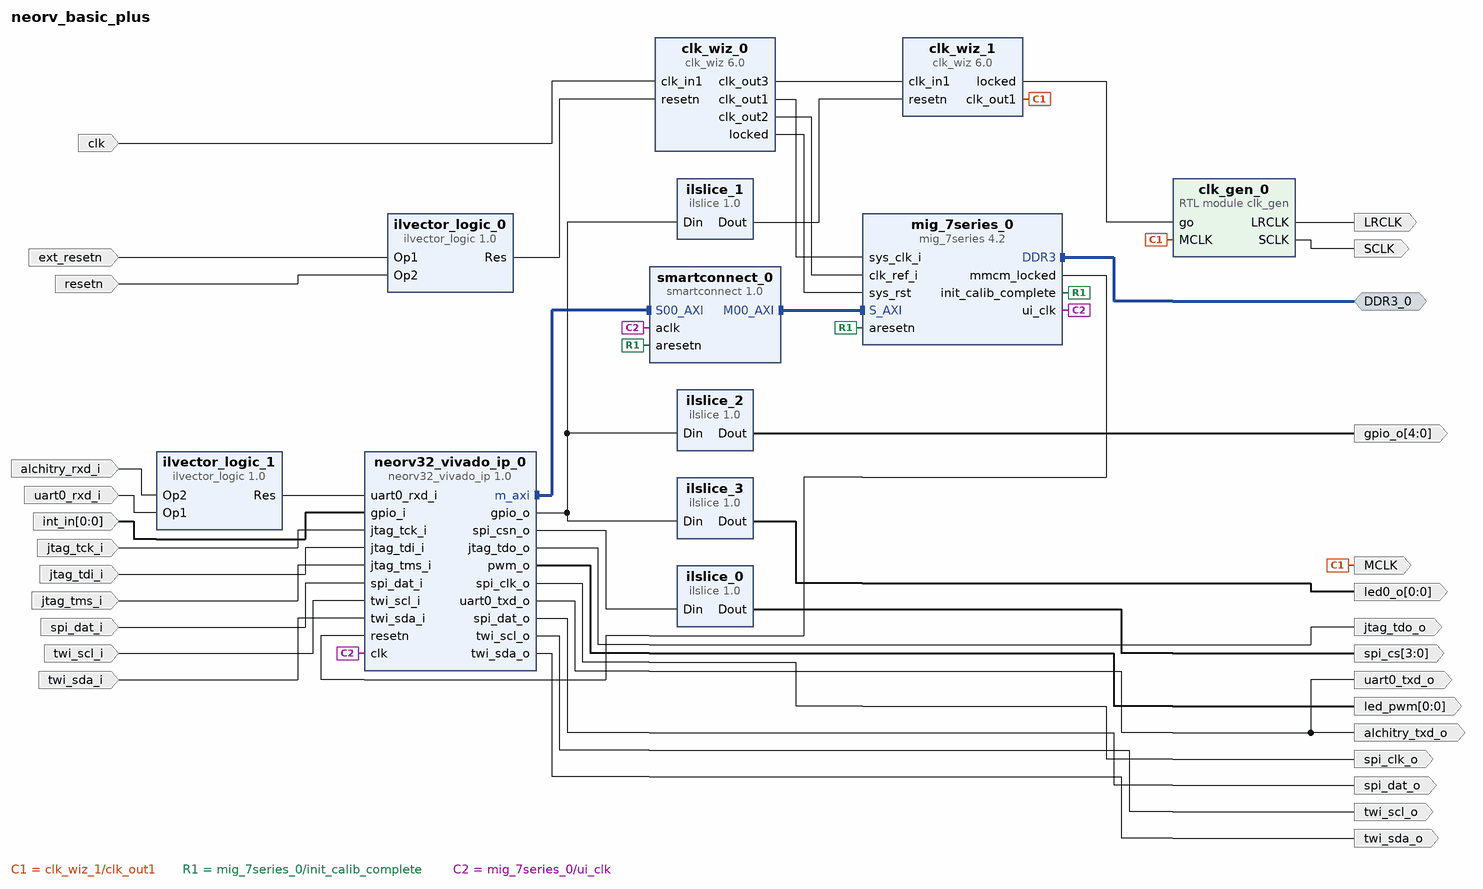
[diagram p0: block diagram of the top level]
# Vivado block design neorv_basic_plus, xc7a100tfgg484-2, Vivado 2025.2
create_bd_design neorv_basic_plus

create_bd_intf_port -mode Master -vlnv xilinx.com:interface:ddrx_rtl:1.0 DDR3_0
create_bd_port -dir O LRCLK
create_bd_port -dir O SCLK
create_bd_port -dir I -type clk clk
set_property -dict {CONFIG.ASSOCIATED_RESET ext_resetn} [get_bd_ports clk]
create_bd_port -dir I -from 0 -to 0 int_in
create_bd_port -dir O -from 4 -to 0 gpio_o
create_bd_port -dir I jtag_tck_i
create_bd_port -dir I jtag_tdi_i
create_bd_port -dir O jtag_tdo_o
create_bd_port -dir I jtag_tms_i
create_bd_port -dir O -from 0 -to 0 led_pwm
create_bd_port -dir I -type rst resetn
create_bd_port -dir O spi_clk_o
create_bd_port -dir I spi_dat_i
create_bd_port -dir O spi_dat_o
create_bd_port -dir I twi_scl_i
create_bd_port -dir O twi_scl_o
create_bd_port -dir I twi_sda_i
create_bd_port -dir O twi_sda_o
create_bd_port -dir I uart0_rxd_i
create_bd_port -dir O uart0_txd_o
create_bd_port -dir O -from 3 -to 0 spi_cs
create_bd_port -dir O -type clk MCLK
create_bd_port -dir I -type rst ext_resetn
create_bd_port -dir O -from 0 -to 0 led0_o
create_bd_port -dir I alchitry_rxd_i
create_bd_port -dir O alchitry_txd_o

create_bd_cell -type module -reference clk_gen clk_gen_0
create_bd_cell -type ip -vlnv xilinx.com:ip:clk_wiz:6.0 clk_wiz_0
set_property -dict [list \
  CONFIG.CLKOUT1_JITTER 130.958 \
  CONFIG.CLKOUT1_PHASE_ERROR 98.575 \
  CONFIG.CLKOUT1_REQUESTED_OUT_FREQ 100 \
  CONFIG.CLKOUT1_USED true \
  CONFIG.CLKOUT2_JITTER 114.829 \
  CONFIG.CLKOUT2_PHASE_ERROR 98.575 \
  CONFIG.CLKOUT2_REQUESTED_OUT_FREQ 200 \
  CONFIG.CLKOUT2_USED true \
  CONFIG.CLKOUT3_JITTER 130.958 \
  CONFIG.CLKOUT3_PHASE_ERROR 98.575 \
  CONFIG.CLKOUT3_REQUESTED_OUT_FREQ 100 \
  CONFIG.CLKOUT3_USED true \
  CONFIG.MMCM_CLKFBOUT_MULT_F 10.000 \
  CONFIG.MMCM_CLKOUT0_DIVIDE_F 10.000 \
  CONFIG.MMCM_CLKOUT1_DIVIDE 5 \
  CONFIG.MMCM_CLKOUT2_DIVIDE 10 \
  CONFIG.NUM_OUT_CLKS 3 \
  CONFIG.RESET_PORT resetn \
  CONFIG.RESET_TYPE ACTIVE_LOW \
] [get_bd_cells clk_wiz_0]
create_bd_cell -type ip -vlnv xilinx.com:ip:clk_wiz:6.0 clk_wiz_1
set_property -dict [list \
  CONFIG.CLKOUT1_JITTER 360.948 \
  CONFIG.CLKOUT1_PHASE_ERROR 301.601 \
  CONFIG.CLKOUT1_REQUESTED_OUT_FREQ 12.288 \
  CONFIG.CLKOUT2_JITTER 130.958 \
  CONFIG.CLKOUT2_PHASE_ERROR 98.575 \
  CONFIG.CLKOUT2_USED false \
  CONFIG.MMCM_CLKFBOUT_MULT_F 48.000 \
  CONFIG.MMCM_CLKOUT0_DIVIDE_F 78.125 \
  CONFIG.MMCM_CLKOUT1_DIVIDE 1 \
  CONFIG.MMCM_DIVCLK_DIVIDE 5 \
  CONFIG.NUM_OUT_CLKS 1 \
  CONFIG.RESET_PORT resetn \
  CONFIG.RESET_TYPE ACTIVE_LOW \
] [get_bd_cells clk_wiz_1]
create_bd_cell -type inline_hdl -vlnv xilinx.com:inline_hdl:ilslice:1.0 ilslice_0
set_property -dict {CONFIG.DIN_FROM 3 CONFIG.DIN_WIDTH 8} [get_bd_cells ilslice_0]
create_bd_cell -type inline_hdl -vlnv xilinx.com:inline_hdl:ilslice:1.0 ilslice_1
set_property -dict {CONFIG.DIN_FROM 6 CONFIG.DIN_TO 6 CONFIG.DIN_WIDTH 7} [get_bd_cells ilslice_1]
create_bd_cell -type inline_hdl -vlnv xilinx.com:inline_hdl:ilslice:1.0 ilslice_2
set_property -dict {CONFIG.DIN_FROM 5 CONFIG.DIN_TO 1 CONFIG.DIN_WIDTH 7} [get_bd_cells ilslice_2]
create_bd_cell -type ip -vlnv NEORV32:user:neorv32_vivado_ip:1.0 neorv32_vivado_ip_0
set_property -dict [list \
  CONFIG.BOOT_MODE_SELECT 0 \
  CONFIG.CLOCK_FREQUENCY 100000000 \
  CONFIG.CPU_FAST_MUL_EN true \
  CONFIG.CPU_FAST_SHIFT_EN true \
  CONFIG.DMEM_EN true \
  CONFIG.DMEM_SIZE 131072 \
  CONFIG.IMEM_EN true \
  CONFIG.IMEM_SIZE 131072 \
  CONFIG.IO_GPIO_EN true \
  CONFIG.IO_GPIO_OUT_NUM 7 \
  CONFIG.IO_PWM_EN true \
  CONFIG.IO_SPI_EN true \
  CONFIG.IO_SPI_FIFO 256 \
  CONFIG.IO_TWI_EN true \
  CONFIG.IO_TWI_FIFO 8 \
  CONFIG.IO_UART0_EN true \
  CONFIG.IO_UART0_RX_FIFO 16 \
  CONFIG.IO_UART0_TX_FIFO 16 \
  CONFIG.OCD_EN true \
  CONFIG.RISCV_ISA_C false \
  CONFIG.RISCV_ISA_M true \
  CONFIG.RISCV_ISA_Zaamo false \
  CONFIG.RISCV_ISA_Zba false \
  CONFIG.RISCV_ISA_Zicond true \
  CONFIG.XBUS_EN true \
] [get_bd_cells neorv32_vivado_ip_0]
create_bd_cell -type ip -vlnv xilinx.com:ip:mig_7series:4.2 mig_7series_0
set_property -dict [list \
  CONFIG.BOARD_MIG_PARAM Custom \
  CONFIG.MIG_DONT_TOUCH_PARAM Custom \
  CONFIG.RESET_BOARD_INTERFACE Custom \
  CONFIG.XML_INPUT_FILE mig_b.prj \
] [get_bd_cells mig_7series_0]
create_bd_cell -type ip -vlnv xilinx.com:ip:smartconnect:1.0 smartconnect_0
set_property -dict {CONFIG.NUM_SI 1} [get_bd_cells smartconnect_0]
create_bd_cell -type inline_hdl -vlnv xilinx.com:inline_hdl:ilvector_logic:1.0 ilvector_logic_0
set_property -dict {CONFIG.C_SIZE 1} [get_bd_cells ilvector_logic_0]
create_bd_cell -type inline_hdl -vlnv xilinx.com:inline_hdl:ilslice:1.0 ilslice_3
set_property -dict {CONFIG.DIN_FROM 0 CONFIG.DIN_WIDTH 7} [get_bd_cells ilslice_3]
create_bd_cell -type inline_hdl -vlnv xilinx.com:inline_hdl:ilvector_logic:1.0 ilvector_logic_1
set_property -dict {CONFIG.C_SIZE 1} [get_bd_cells ilvector_logic_1]

# ---- connections ----

connect_bd_intf_net [get_bd_intf_ports DDR3_0] [get_bd_intf_pins mig_7series_0/DDR3]
connect_bd_intf_net [get_bd_intf_pins neorv32_vivado_ip_0/m_axi] [get_bd_intf_pins smartconnect_0/S00_AXI]
connect_bd_intf_net [get_bd_intf_pins smartconnect_0/M00_AXI] [get_bd_intf_pins mig_7series_0/S_AXI]
connect_bd_net [get_bd_pins neorv32_vivado_ip_0/gpio_o] [get_bd_pins ilslice_1/Din] [get_bd_pins ilslice_2/Din] [get_bd_pins ilslice_3/Din]
connect_bd_net -net alchitry_rx_i_1 [get_bd_ports alchitry_rxd_i] [get_bd_pins ilvector_logic_1/Op2]
connect_bd_net [get_bd_ports clk] [get_bd_pins clk_wiz_0/clk_in1]
connect_bd_net [get_bd_pins clk_gen_0/LRCLK] [get_bd_ports LRCLK]
connect_bd_net [get_bd_pins clk_gen_0/SCLK] [get_bd_ports SCLK]
connect_bd_net [get_bd_pins clk_wiz_0/clk_out1] [get_bd_pins mig_7series_0/sys_clk_i]
connect_bd_net [get_bd_pins clk_wiz_0/clk_out2] [get_bd_pins mig_7series_0/clk_ref_i]
connect_bd_net [get_bd_pins clk_wiz_0/clk_out3] [get_bd_pins clk_wiz_1/clk_in1]
connect_bd_net [get_bd_pins clk_wiz_0/locked] [get_bd_pins mig_7series_0/sys_rst]
connect_bd_net [get_bd_pins clk_wiz_1/clk_out1] [get_bd_pins clk_gen_0/MCLK] [get_bd_ports MCLK]
connect_bd_net [get_bd_pins clk_wiz_1/locked] [get_bd_pins clk_gen_0/go]
connect_bd_net -net gpio_i_0_1 [get_bd_ports int_in] [get_bd_pins neorv32_vivado_ip_0/gpio_i]
connect_bd_net [get_bd_pins ilslice_0/Dout] [get_bd_ports spi_cs]
connect_bd_net [get_bd_pins ilslice_1/Dout] [get_bd_pins clk_wiz_1/resetn]
connect_bd_net [get_bd_pins ilslice_2/Dout] [get_bd_ports gpio_o]
connect_bd_net [get_bd_pins ilslice_3/Dout] [get_bd_ports led0_o]
connect_bd_net [get_bd_pins ilvector_logic_0/Res] [get_bd_pins clk_wiz_0/resetn]
connect_bd_net [get_bd_pins ilvector_logic_1/Res] [get_bd_pins neorv32_vivado_ip_0/uart0_rxd_i]
connect_bd_net -net jtag_tck_i_0_1 [get_bd_ports jtag_tck_i] [get_bd_pins neorv32_vivado_ip_0/jtag_tck_i]
connect_bd_net -net jtag_tdi_i_0_1 [get_bd_ports jtag_tdi_i] [get_bd_pins neorv32_vivado_ip_0/jtag_tdi_i]
connect_bd_net -net jtag_tms_i_0_1 [get_bd_ports jtag_tms_i] [get_bd_pins neorv32_vivado_ip_0/jtag_tms_i]
connect_bd_net [get_bd_pins mig_7series_0/init_calib_complete] [get_bd_pins smartconnect_0/aresetn] [get_bd_pins mig_7series_0/aresetn]
connect_bd_net [get_bd_pins mig_7series_0/mmcm_locked] [get_bd_pins neorv32_vivado_ip_0/resetn]
connect_bd_net [get_bd_pins mig_7series_0/ui_clk] [get_bd_pins smartconnect_0/aclk] [get_bd_pins neorv32_vivado_ip_0/clk]
connect_bd_net [get_bd_pins neorv32_vivado_ip_0/jtag_tdo_o] [get_bd_ports jtag_tdo_o]
connect_bd_net [get_bd_pins neorv32_vivado_ip_0/pwm_o] [get_bd_ports led_pwm]
connect_bd_net [get_bd_pins neorv32_vivado_ip_0/spi_clk_o] [get_bd_ports spi_clk_o]
connect_bd_net [get_bd_pins neorv32_vivado_ip_0/spi_csn_o] [get_bd_pins ilslice_0/Din]
connect_bd_net [get_bd_pins neorv32_vivado_ip_0/spi_dat_o] [get_bd_ports spi_dat_o]
connect_bd_net [get_bd_pins neorv32_vivado_ip_0/twi_scl_o] [get_bd_ports twi_scl_o]
connect_bd_net [get_bd_pins neorv32_vivado_ip_0/twi_sda_o] [get_bd_ports twi_sda_o]
connect_bd_net [get_bd_pins neorv32_vivado_ip_0/uart0_txd_o] [get_bd_ports uart0_txd_o] [get_bd_ports alchitry_txd_o]
connect_bd_net -net resetn1_1 [get_bd_ports ext_resetn] [get_bd_pins ilvector_logic_0/Op1]
connect_bd_net [get_bd_ports resetn] [get_bd_pins ilvector_logic_0/Op2]
connect_bd_net -net spi_dat_i_0_1 [get_bd_ports spi_dat_i] [get_bd_pins neorv32_vivado_ip_0/spi_dat_i]
connect_bd_net -net twi_scl_i_0_1 [get_bd_ports twi_scl_i] [get_bd_pins neorv32_vivado_ip_0/twi_scl_i]
connect_bd_net -net twi_sda_i_0_1 [get_bd_ports twi_sda_i] [get_bd_pins neorv32_vivado_ip_0/twi_sda_i]
connect_bd_net [get_bd_ports uart0_rxd_i] [get_bd_pins ilvector_logic_1/Op1]

# ---- address map ----
assign_bd_address -offset 0x20000000 -range 256M -target_address_space [get_bd_addr_spaces neorv32_vivado_ip_0/m_axi] [get_bd_addr_segs mig_7series_0/memmap/memaddr]

validate_bd_design
save_bd_design
